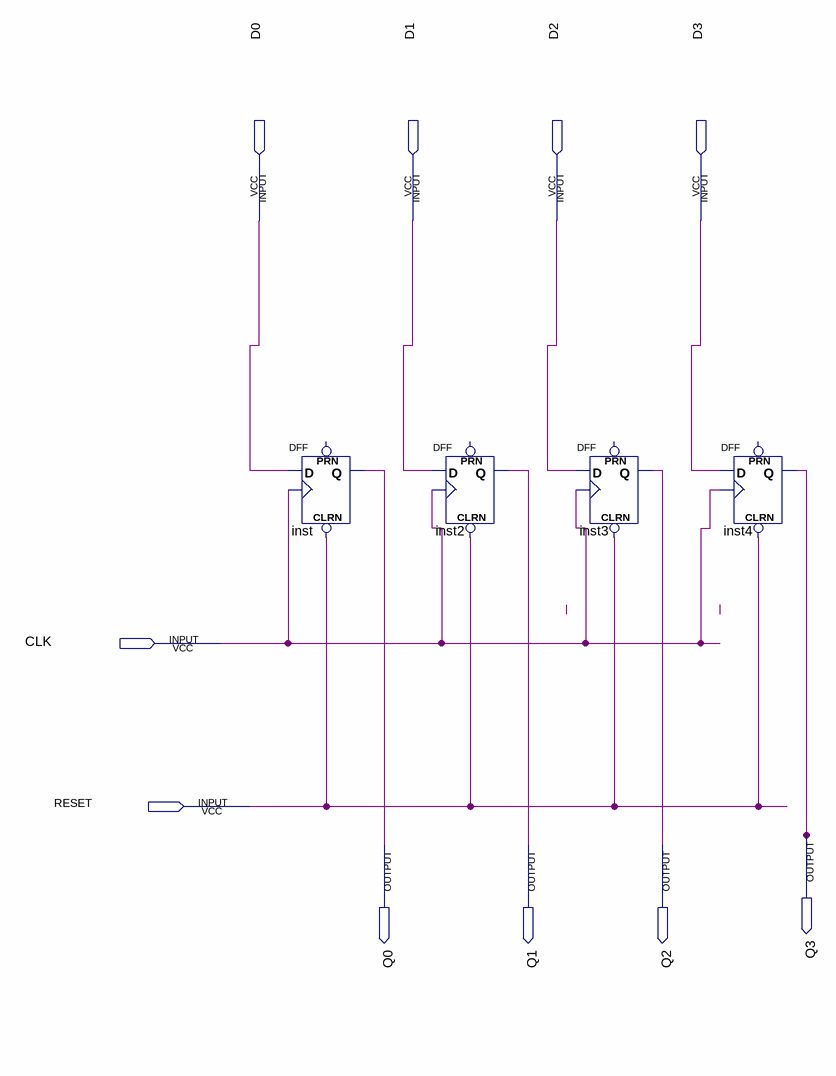
[diagram p0: schematic sheet]
// Quartus schematic Fourweek_ex4.bdf as structural Verilog: 4 symbols, 10 pins
module Fourweek_ex4 (
  input  D0,
  input  D1,
  input  D2,
  input  D3,
  input  CLK,
  input  RESET,
  output Q3,
  output Q0,
  output Q1,
  output Q2
);

  DFF inst (.CLRN(RESET), .CLK(CLK), .D(D0), .Q(Q0));  // open: PRN
  DFF inst2 (.CLRN(RESET), .CLK(CLK), .D(D1), .Q(Q1));  // open: PRN
  DFF inst3 (.CLRN(RESET), .CLK(CLK), .D(D2), .Q(Q2));  // open: PRN
  DFF inst4 (.CLRN(RESET), .CLK(CLK), .D(D3), .Q(Q3));  // open: PRN
endmodule
